# EAGLE design wav player 861 mosfet 5x5 (EAGLE 6.5.0)
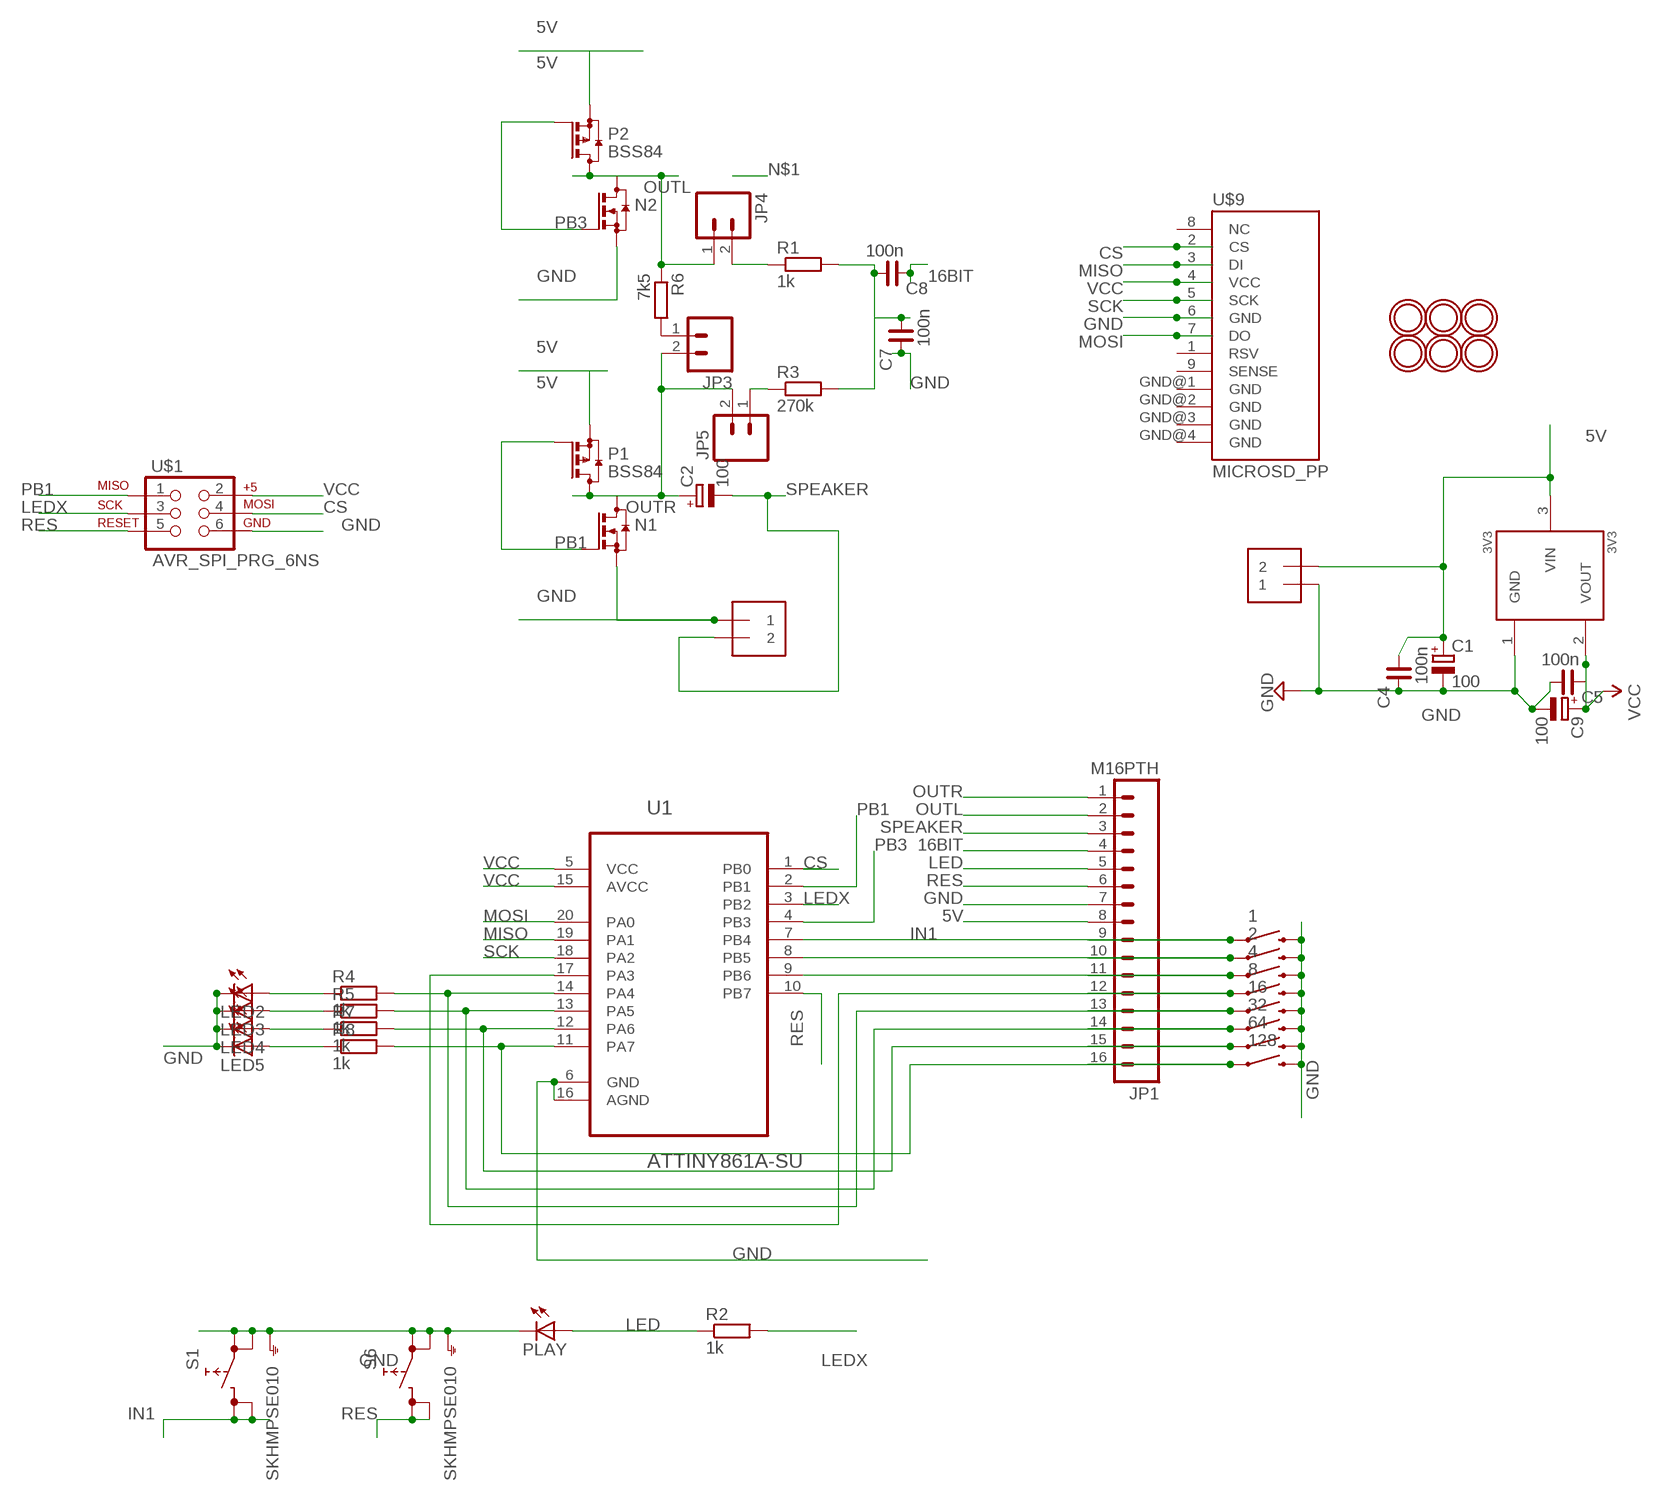
[diagram p0: schematic, sheet 1]

## Parts
1  SWITCH-MOMENTARY-2-SMD-1101NE  [TACTILE-SWITCH-1101NE]
2  SWITCH-MOMENTARY-2-SMD-1101NE  [TACTILE-SWITCH-1101NE]
3V3  3V3  MCP1700T  [SOT23]
4  SWITCH-MOMENTARY-2-SMD-1101NE  [TACTILE-SWITCH-1101NE]
8  SWITCH-MOMENTARY-2-SMD-1101NE  [TACTILE-SWITCH-1101NE]
16  SWITCH-MOMENTARY-2-SMD-1101NE  [TACTILE-SWITCH-1101NE]
32  SWITCH-MOMENTARY-2-SMD-1101NE  [TACTILE-SWITCH-1101NE]
64  SWITCH-MOMENTARY-2-SMD-1101NE  [TACTILE-SWITCH-1101NE]
128  SWITCH-MOMENTARY-2-SMD-1101NE  [TACTILE-SWITCH-1101NE]
C1  100  CPOL-EU153CLV-0605  [153CLV-0605]
C2  100  CPOL-EU153CLV-0605  [153CLV-0605]
C4  100n  C_0603  [C0603]
C5  100n  C_0603  [C0603]
C7  100n  C_0603  [C0603]
C8  100n  C_0603  [C0603]
C9  100  CPOL-EU153CLV-0605  [153CLV-0605]
J1  1X2-3.5MM  [1X2-3.5MM]
J2  1X2-3.5MM  [1X2-3.5MM]
JP1  M16PTH  [1X16]
JP3  M02PTH  [1X02]
JP4  M02PTH  [1X02]
JP5  M02PTH  [1X02]
LED2  LED3MM  [LED3MM]
LED3  LED3MM  [LED3MM]
LED4  LED3MM  [LED3MM]
LED5  LED3MM  [LED3MM]
N1  BSS123  [SOT23]
N2  BSS123  [SOT23]
P1  BSS84  [SOT23]
P2  BSS84  [SOT23]
PLAY  LED3MM  [LED3MM]
R1  1k  R-EU_R0603  [R0603]
R2  1k  R-EU_R0603  [R0603]
R3  270k  R-EU_R0603  [R0603]
R4  1k  R-EU_R0603  [R0603]
R5  1k  R-EU_R0603  [R0603]
R6  7k5  R-EU_R0603  [R0603]
R7  1k  R-EU_R0603  [R0603]
R8  1k  R-EU_R0603  [R0603]
S1  SKHMPSE010  [SKHMPXE010]
S6  SKHMPSE010  [SKHMPXE010]
U1  ATTINY861A-SU  [SOIC127P1032X265-20N]
U$1  AVR_SPI_PRG_6NS  [2X3-NS]
U$2  MOUNTINGHOLE2.0  [MOUNTINGHOLE_2.0_PLATED]
U$3  MOUNTINGHOLE2.0  [MOUNTINGHOLE_2.0_PLATED]
U$4  MOUNTINGHOLE2.0  [MOUNTINGHOLE_2.0_PLATED]
U$5  MOUNTINGHOLE2.0  [MOUNTINGHOLE_2.0_PLATED]
U$6  MOUNTINGHOLE2.0  [MOUNTINGHOLE_2.0_PLATED]
U$7  MOUNTINGHOLE2.0  [MOUNTINGHOLE_2.0_PLATED]
U$9  MICROSD_PP  [MICROSD_PP]

## Nets
5V [GND]: 3V3.3(VIN) C1.+ C4.1 J2.2 JP1.8 P1.2(S) P2.2(S)
16BIT: C8.2 JP1.4
CS: U1.1(PB0) U$1.4 U$9.2(CS)
GND: 1.P$2 2.P$2 3V3.1(GND) 4.P$2 8.P$2 16.P$2 32.P$2 64.P$2 128.P$2 C1.- C4.2 C5.1 C7.2 C9.- J1.1 J2.1 JP1.7 LED2.K(C) LED3.K(C) LED4.K(C) LED5.K(C) N1.2(S) N2.2(S) PLAY.K(C) S1.1(1.1) S1.2(1.2) S1.5(SH) S6.1(1.1) S6.2(1.2) S6.5(SH) U1.6(GND) U1.16(AGND) U$1.6 U$9.6(GND)
IN1: 1.P$1 JP1.9 S1.3(2.1) S1.4(2.2) U1.7(PB4)
LED: JP1.5 PLAY.A R2.1
LEDX: R2.2 U1.3(PB2) U$1.3
MISO: U1.19(PA1) U$9.3(DI)
MOSI: U1.20(PA0) U$9.7(DO)
N$2: JP3.1 R6.2
N$3: C7.1 C8.1 R1.2 R3.2
N$4: LED2.A R4.1
N$5: LED3.A R5.1
N$6: LED4.A R7.1
N$7: LED5.A R8.1
N$8: JP5.1 R3.1
N$9: JP4.2 R1.1
N$12: 2.P$1 JP1.10 U1.8(PB5)
N$13: 4.P$1 JP1.11 U1.9(PB6)
N$14: 8.P$1 JP1.12 U1.17(PA3)
N$15: 16.P$1 JP1.13 R4.2 U1.14(PA4)
N$16: 32.P$1 JP1.14 R5.2 U1.13(PA5)
N$17: 64.P$1 JP1.15 R7.2 U1.12(PA6)
N$18: 128.P$1 JP1.16 R8.2 U1.11(PA7)
OUTL: JP1.2 JP4.1 N2.3(D) P2.3(D) R6.1
OUTR: C2.+ JP1.1 JP3.2 JP5.2 N1.3(D) P1.3(D)
PB1: N1.1(G) P1.1(G) U1.2(PB1) U$1.1
PB3: N2.1(G) P2.1(G) U1.4(PB3)
RES: JP1.6 S6.3(2.1) S6.4(2.2) U1.10(PB7) U$1.5
SCK: U1.18(PA2) U$9.5(SCK)
SPEAKER: C2.- J1.2 JP1.3
VCC: 3V3.2(VOUT) C5.2 C9.+ U1.5(VCC) U1.15(AVCC) U$1.2 U$9.4(VCC)
Unconnected: U$9.1(RSV) U$9.8(NC) U$9.9(SENSE) U$9.GND@1(GND) U$9.GND@2(GND) U$9.GND@3(GND) U$9.GND@4(GND)

## Library data of the parts
1 2 4 8 16 32 64 128 = SparkFun:SWITCH-MOMENTARY-2
3V3 = okie:MCP1700T
C1 C2 C9 = resistor:CPOL-EU: POLARIZED CAPACITOR, European symbol
C4 C5 C7 C8 = rc-master-smd:C_: NON-POLARIZED CAP
J1 J2 = adafruit:1X2: 3.5mm Terminal block http://www.ladyada.net/library/pcb/eaglelibrary.html
JP1 = SparkFun:M16
JP3-JP5 = SparkFun:M02: Header 2 Standard 2-pin 0.1" header. Use with straight break away headers (SKU : PRT-00116), right angle break away headers (PRT-00553), swiss pins (PRT-00743), machine pins (PRT-00117), and female headers (PRT-00115). Molex polarized connector foot print use with SKU : PRT-08233 with associated crimp pins and housings.
LED2-LED5 PLAY = led:LED: LED OSRAM: - CHIPLED LG R971, LG N971, LY N971, LG Q971, LY Q971, LO R971, LY R971 LH N974, LH R974 LS Q976, LO Q976, LY Q976 LO Q996 - Hyper CHIPLED LW Q18S LB Q993, LB Q99A, LB R99A - SideLED LS A670, LO A670, LY A670, LG A670, LP A670 LB A673, LV A673, LT A673, LW A673 LH A674 LY A675 LS A676, LA A676, LO A676, LY A676, LW A676 LS A679, LY A679, LG A679 - Hyper Micro SIDELED® LS Y876, LA Y876, LO Y876, LY Y876 LT Y87S - SmartLED LW L88C, LW L88S LB L89C, LB L89S, LG L890 LS L89K, LO L89K, LY L89K LS L896, LA L896, LO L896, LY L896 - TOPLED LS T670, LO T670, LY T670, LG T670, LP T670 LSG T670, LSP T670, LSY T670, LOP T670, LYG T670 LG T671, LOG T671, LSG T671 LB T673, LV T673, LT T673, LW T673 LH T674 LS T676, LA T676, LO T676, LY T676, LB T676, LH T676, LSB T676, LW T676 LB T67C, LV T67C, LT T67C, LS T67K, LO T67K, LY T67K, LW E67C LS E67B, LA E67B, LO E67B, LY E67B, LB E67C, LV E67C, LT E67C LW T67C LS T679, LY T679, LG T679 LS T770, LO T770, LY T770, LG T770, LP T770 LB T773, LV T773, LT T773, LW T773 LH T774 LS E675, LA E675, LY E675, LS T675 LS T776, LA T776, LO T776, LY T776, LB T776 LHGB T686 LT T68C, LB T68C - Hyper Mini TOPLED® LB M676 - Mini TOPLED Santana® LG M470 LS M47K, LO M47K, LY M47K Source: http://www.osram.convergy.de LUXEON: - LUMILED® LXK2-PW12-R00, LXK2-PW12-S00, LXK2-PW14-U00, LXK2-PW14-V00 LXK2-PM12-R00, LXK2-PM12-S00, LXK2-PM14-U00 LXK2-PE12-Q00, LXK2-PE12-R00, LXK2-PE12-S00, LXK2-PE14-T00, LXK2-PE14-U00 LXK2-PB12-K00, LXK2-PB12-L00, LXK2-PB12-M00, LXK2-PB14-N00, LXK2-PB14-P00, LXK2-PB14-Q00 LXK2-PR12-L00, LXK2-PR12-M00, LXK2-PR14-Q00, LXK2-PR14-R00 LXK2-PD12-Q00, LXK2-PD12-R00, LXK2-PD12-S00 LXK2-PH12-R00, LXK2-PH12-S00 LXK2-PL12-P00, LXK2-PL12-Q00, LXK2-PL12-R00 Source: www.luxeon.com KINGBRIGHT: KA-3528ASYC Source: www.kingbright.com
N1 N2 = transistor-small-signal:BSS123: N-CHANNEL MOS FET
P1 P2 = transistor-small-signal:BSS84: P-CHANNEL MOS FET
R1-R8 = resistor:R-EU_: RESISTOR, European symbol
S1 S6 = switch:SKHMP*E010: 6.2 X 6.5mm TACT Switch (SMD) Source: http://www3.alps.co.jp/WebObjects/catalog.woa/PDF/E/Switch/Tact/SKHM/SKHM.PDF
U1 = Atmel_By_element14_Batch_1-00:ATTINY861A-SU: 8-bit Microcontroller with In-System Programmable Flash; MPN: ATTINY861A-SU; OC_FARNELL: 1841628; OC_NEWARK: 12T1344; PACKAGE: SOIC-20; SUPPLIER: Atmel
U$1 = SparkFun:AVR_SPI_PRG_6: AVR ISP 6 Pin This is the reduced ISP connector for AVR programming. Common on Arduino. This footprint will take up less PCB space and can be used with a 10-pin to 6-pin adapter such as SKU: BOB-08508
U$2-U$7 = microbuilder:MOUNTINGHOLE: Mounting Hole
U$9 = DE1594-v2:MICROSD_PP

## Net classes
0 default: width 0.305 mm, drill 0.381 mm, clearance 0.381 mm
1 GND: width 0.305 mm, drill 0.381 mm, clearance 0.381 mm
2 pwr: width 0.305 mm, drill 0.381 mm, clearance 0.381 mm

## Board
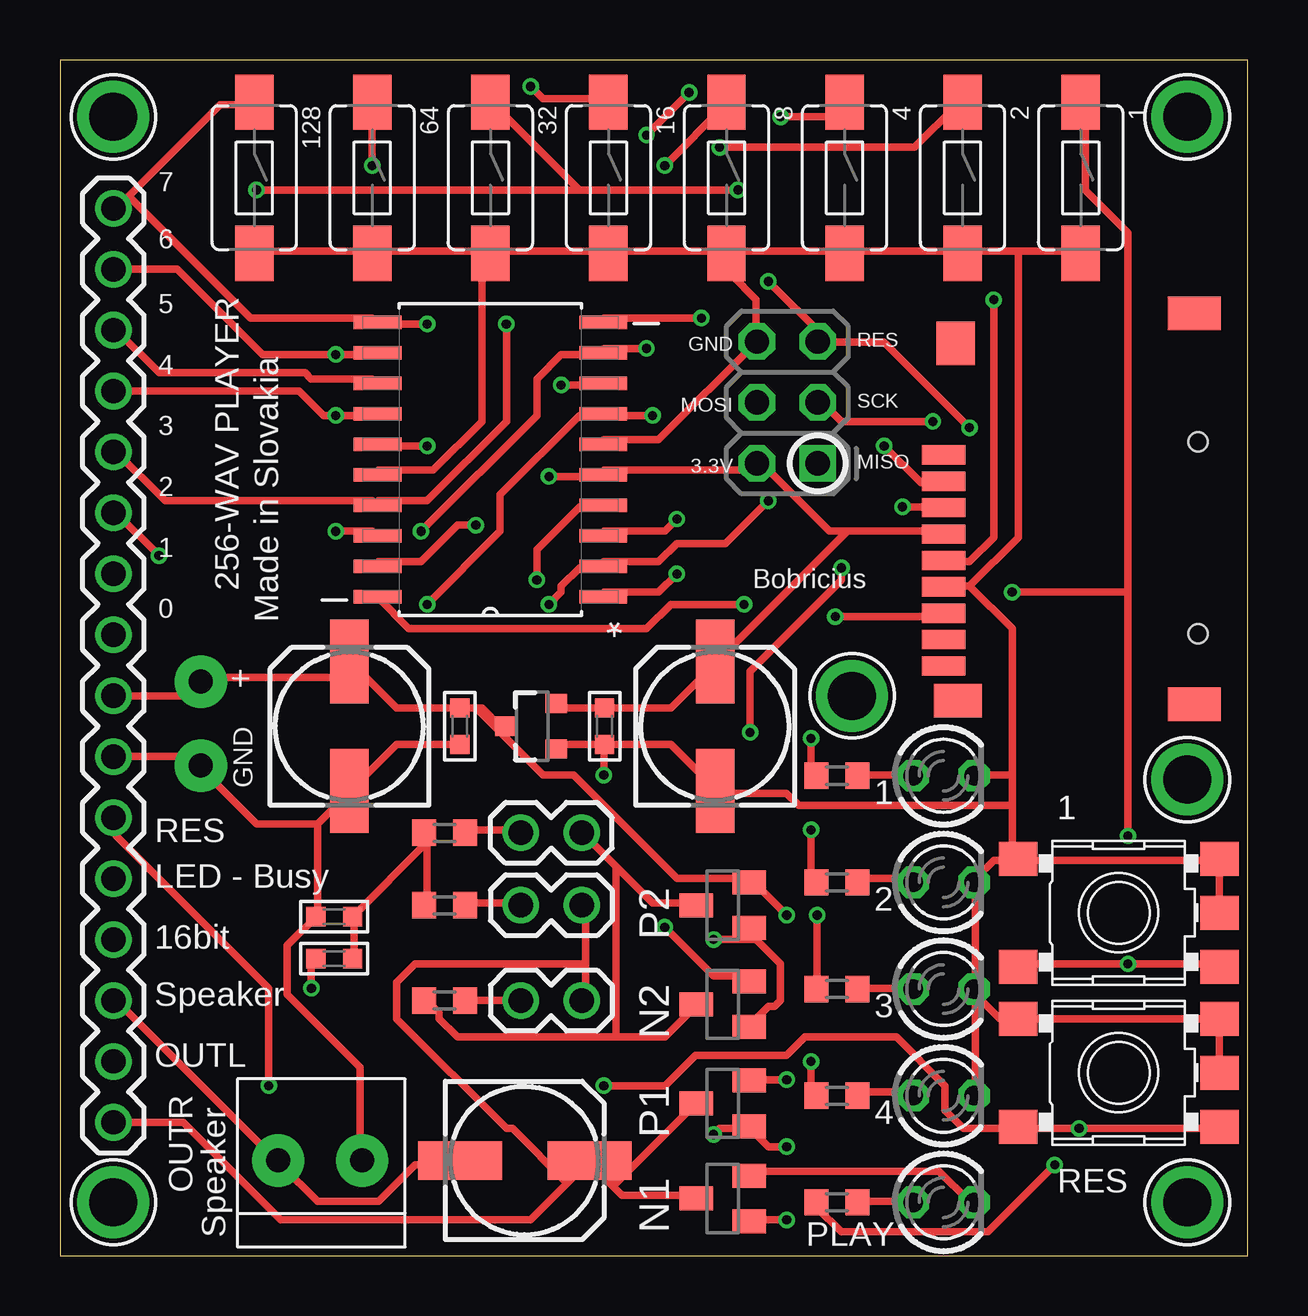
[diagram p1: board, top side]
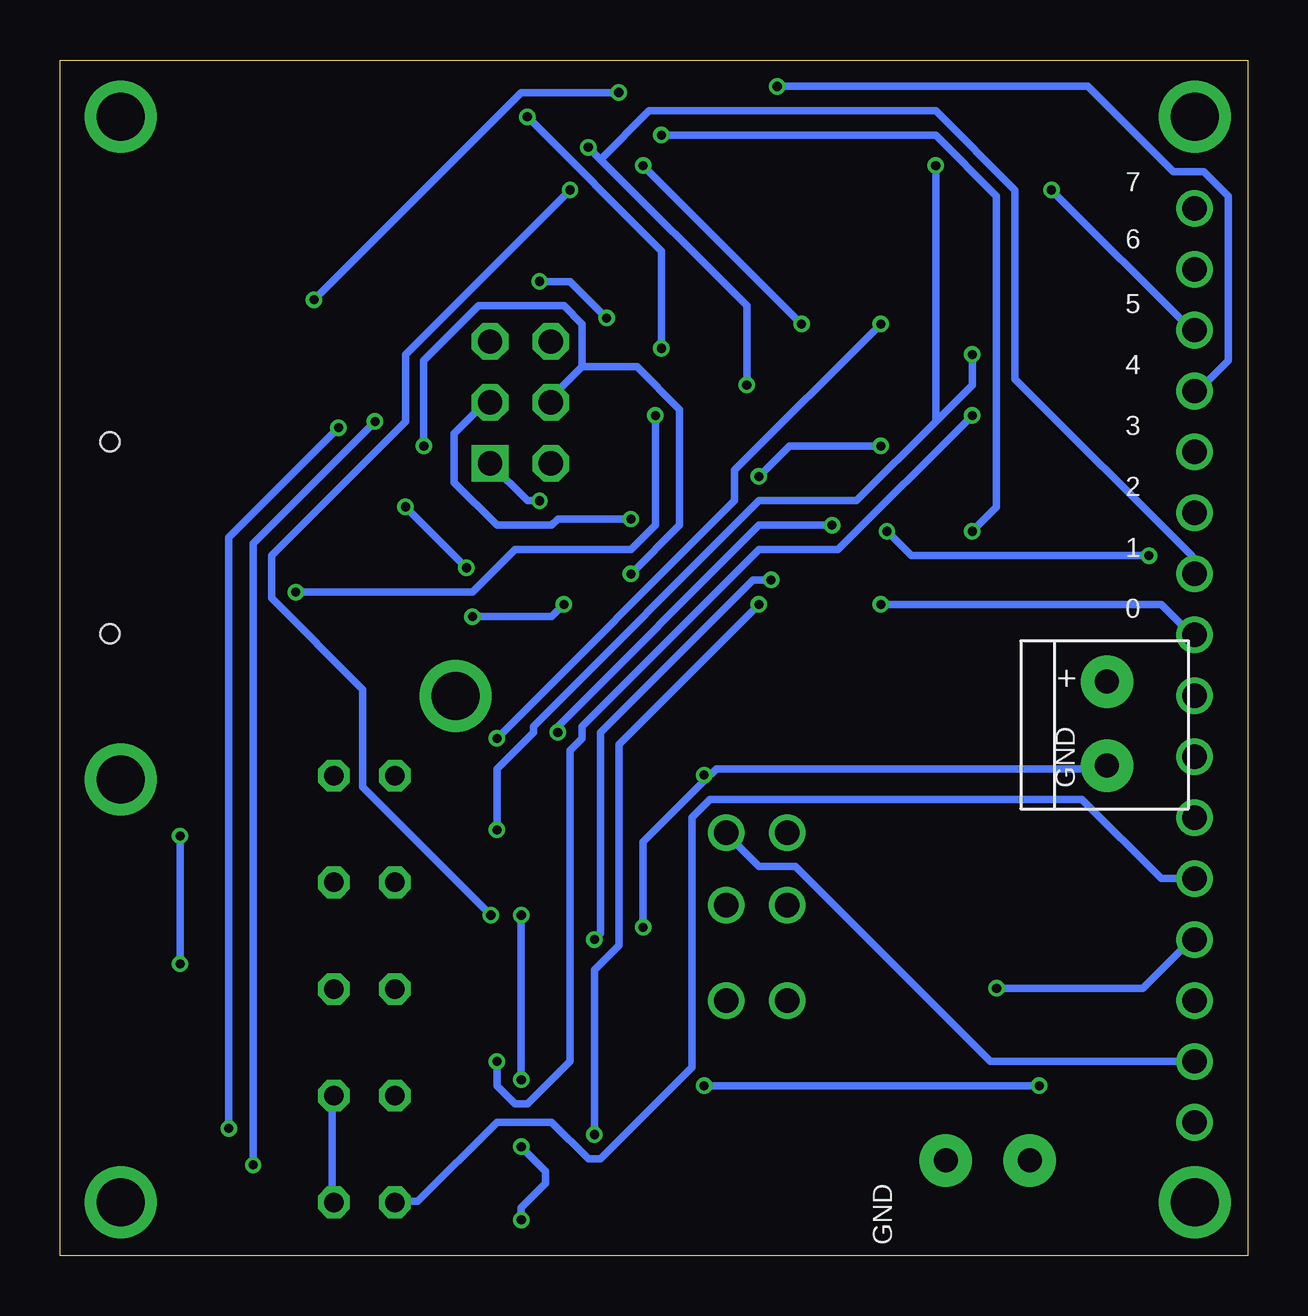
[diagram p2: board, bottom side, seen from below]

Size 49.52 x 49.84 mm. Coordinates in mm from the lower left corner, seen from the top.
Outline: 0,0 49.52,0 49.52,49.84 0,49.84 0,0
Copper layers (1*16): Top 0.035mm / dielectric 1.5mm / Bottom 0.035mm
Design rules "ITEADstudio_DRC": minimum track width 6mil, minimum drill 12mil, track to track 6mil, track to pad 6mil, pad to pad 6mil, via to via 6mil, smd to smd 0mil, copper to edge 10mil, drill to drill 10mil, minimum pad ring 10mil, minimum via ring 6mil, stop-mask expansion 2mil, vias tented up to drill 100mil, thermal gap 10mil

### Footprints (pad centres in the part's own frame; a part is rotated, then mirrored left to right if it is on the bottom)
TACTILE-SWITCH-1101NE = smd 2.3 x 1.6: P$1 -3.15,0; P$2 3.15,0
SOT23 = smd 0.8 x 0.9: 1 -0.95,-1; 2 0.95,-1; 3 0,1.1
153CLV-0605 = smd 3.5 x 1.6: + 2.7,0; - -2.7,0
C0603 = smd 0.8 x 0.8: 1 -0.762,0; 2 0.762,0
1X2-3.5MM = drill 1 pad 2.184: 1 1.8,0; 2 -1.7,0
1X16 = drill 1.016: 1 0,0; 2 2.54,0; 3 5.08,0; 4 7.62,0; 5 10.16,0; 6 12.7,0; 7 15.24,0; 8 17.78,0; 9 20.32,0; 10 22.86,0; 11 25.4,0; 12 27.94,0; 13 30.48,0; 14 33.02,0; 15 35.56,0; 16 38.1,0
1X02 = drill 1.016: 1 0,0; 2 2.54,0
LED3MM = drill 0.813 octagon: A -1.27,0; K 1.27,0
SOT23' = smd 1 x 1.4: 1 -0.95,-1.1; 2 0.95,-1.1; 3 0,1.1
R0603 = smd 1 x 1.1: 1 -0.85,0; 2 0.85,0
SKHMPXE010 = smd 1.6 x 1.4: 1 -4.2,2.25; 2 4.2,2.25; 3 -4.2,-2.25; 4 4.2,-2.25; 5 4.2,0
SOIC127P1032X265-20N = smd 1.981 x 0.559: 1 -4.699,5.715; 2 -4.699,4.445; 3 -4.699,3.175; 4 -4.699,1.905; 5 -4.699,0.635; 6 -4.699,-0.635; 7 -4.699,-1.905; 8 -4.699,-3.175; 9 -4.699,-4.445; 10 -4.699,-5.715; 11 4.699,-5.715; 12 4.699,-4.445; 13 4.699,-3.175; 14 4.699,-1.905; 15 4.699,-0.635; 16 4.699,0.635; 17 4.699,1.905; 18 4.699,3.175; 19 4.699,4.445; 20 4.699,5.715
2X3-NS = drill 1.016 square: 1 -2.54,-1.27 | drill 1.016 octagon: 2 -2.54,1.27; 3 0,-1.27; 4 0,1.27; 5 2.54,-1.27; 6 2.54,1.27
MOUNTINGHOLE_2.0_PLATED = drill 2 pad 3: P$1 0,0
MICROSD_PP = smd 1.8 x 0.8: 1 0,3.85; 2 0,2.75; 3 0,1.65; 4 0,0.55; 5 0,-0.55; 6 0,-1.65; 7 0,-2.75; 8 0,-3.85; 9 0,-4.95 | smd 1.6 x 1.8: GND@1 0.5,8.5 | smd 2.2 x 1.4: GND@2 10.45,9.75; GND@4 10.45,-6.55 | smd 2 x 1.4: GND@3 0.6,-6.4 | hole 0.8: 10.6,4.4; 10.6,-3.6

### Placement (x,y rotation side)
1  42.55,44.93 270 top
2  37.62,44.93 270 top
3V3  19.69,22.07 90 top
4  32.7,44.93 270 top
8  27.78,44.93 270 top
16  22.86,44.93 270 top
32  17.94,44.93 270 top
64  13.02,44.93 270 top
128  8.1,44.93 270 top
C1  12.07,22.07 90 top
C2  19.37,3.97 0 top
C4  16.67,22.07 270 top
C5  22.7,22.07 90 top
C7  11.43,14.13 180 top
C8  11.43,12.38 180 top
C9  27.3,22.07 90 top
J1  10.8,3.97 0 top
J2  5.87,22.23 270 bottom
JP1  2.22,5.56 90 top
JP3  19.21,10.64 0 top
JP4  21.75,17.62 180 top
JP5  19.21,14.61 0 top
LED2  36.83,6.67 0 top
LED3  36.83,11.11 0 top
LED4  36.83,15.56 0 top
LED5  36.83,20 0 top
N1  BSS123  [SOT23']  27.62,2.38 90 top
N2  BSS123  [SOT23']  27.62,10.48 90 top
P1  BSS84  [SOT23']  27.62,6.35 90 top
P2  BSS84  [SOT23']  27.62,14.61 90 top
PLAY  36.83,2.22 0 top
R1  16.03,17.62 180 top
R2  32.38,2.22 180 top
R3  16.03,14.61 180 top
R4  32.38,6.67 180 top
R5  32.38,11.11 180 top
R6  16.03,10.64 0 top
R7  32.38,15.56 180 top
R8  32.38,20 180 top
S1  44.13,14.29 0 top
S6  44.13,7.62 0 top
U1  17.94,33.18 180 top
U$1  30.32,35.56 90 top
U$2  2.22,2.22 0 top
U$3  2.22,47.47 0 top
U$4  46.99,47.47 0 top
U$5  46.99,2.22 0 top
U$6  33.02,23.34 0 top
U$7  46.99,19.84 0 top
U$9  36.83,29.53 0 top

### Tracks (layer width: path | path; a pad name or v marks a point on that pad's centre or on a via)
5V  (via drill 0.38)
  Top 0.305: JP1.8 5.14,23.34 5.65,23.84 J2.2 5.91,24.1 12.76,24.1 | v30.29,7.33 28.77,7.33 P1.2 | v30.29,14.19 28.77,15.72 P2.2 28.51,15.72 25.72,15.72 21.4,20.03 20.13,20.03 17.34,22.83 | 17.34,22.83 17.59,22.83 18.35,22.07 3V3.3 | 17.34,22.83 C4.1 14.03,22.83 12.76,24.1 | 12.76,24.1 12.26,24.61 C1.+ 12.76,24.1
  Bottom 0.305: v30.29,14.19 v30.29,7.33
16BIT  (via drill 0.38)
  Top 0.305: v10.48,11.14 10.48,12.16 C8.2
  Bottom 0.305: v10.48,11.14 4.38,11.14 2.35,13.18 JP1.4
CS  (via drill 0.38)
  Top 0.305: v34.35,33.75 35.88,32.23 36.64,32.23 U$9.2 | v25.72,28.42 24.96,27.65 22.67,27.65 U1.1
  Bottom 0.305: v34.35,33.75 34.35,37.31 32.07,39.59 28.51,39.59 27.75,38.83 27.75,37.05 | 27.75,37.05 29.02,35.78 U$1.4 | v25.72,28.42 23.69,30.45 23.69,35.27 25.46,37.05 27.75,37.05
GND  (via drill 0.38)
  Top 0.305: 10.73,18 10.73,14.19 C7.2 9.46,12.92 9.46,10.89 12.51,7.84 12.51,4.03 J1.1 | 10.73,18 12,19.27 C1.- 12.26,19.53 14.03,21.3 C4.2 | v25.21,13.68 27.24,11.65 28.51,11.65 N2.2 | JP1.7 5.4,20.8 5.65,20.54 J2.1 5.91,20.29 8.19,18 10.73,18 | 13.02,41.88 8.19,41.88 128.P$2 | U1.16 13.27,32.73 15.56,32.73 17.59,34.77 17.59,41.37 17.84,41.62 32.P$2 | 32.P$2 18.1,41.88 22.67,41.88 16.P$2 22.92,41.88 27.75,41.88 8.P$2 | 13.02,41.88 17.84,41.88 32.P$2 | 13.02,41.88 64.P$2 | U1.6 22.67,34 24.96,34 U$1.6 29.02,38.32 29.02,39.85 28,40.86 28,41.62 8.P$2 | 8.P$2 28,41.88 32.58,41.88 4.P$2 32.83,41.88 37.4,41.88 2.P$2 37.66,41.88 39.94,41.88 | 39.94,41.88 42.48,41.88 1.P$2 | N1.2 28.77,3.52 36.64,3.52 37.91,2.25 PLAY.K | S6.5 48.32,7.84 48.32,9.62 S6.2 48.32,9.87 39.94,9.87 S6.1 39.69,9.87 39.18,9.87 38.16,10.89 | 38.16,10.89 38.16,6.83 LED2.K | 38.16,10.89 LED3.K 38.16,11.14 38.16,15.46 LED4.K 38.16,15.72 38.93,16.48 39.69,16.48 S1.1 | 22.67,21.3 20.89,21.3 3V3.1 | 48.32,16.48 48.32,14.45 S1.5 | 37.91,27.91 36.89,27.91 U$9.6 | 37.91,27.91 39.69,26.13 39.69,20.03 | 39.69,18.76 39.69,16.73 S1.1 | 39.69,18.76 39.69,20.03 | 48.32,16.48 39.94,16.48 S1.1 | 48.32,16.48 S1.2 | 39.69,20.03 38.16,20.03 LED5.K | 39.69,18.76 30.8,18.76 30.29,19.27 27.5,19.27 C9.- 27.24,19.53 25.46,21.3 C5.1 22.67,21.3 | 39.94,41.88 39.94,29.94 37.91,27.91 | 22.67,21.3 v22.67,20.03
  Bottom 0.305: v25.21,13.68 25.21,17.24 22.67,19.78 | 22.67,19.78 22.16,20.29 5.91,20.29 J2.1 | PLAY.K 38.16,2.25 38.16,6.57 LED2.K | v22.67,20.03 22.67,19.78
IN1  (via drill 0.38)
  Top 0.305: v15.3,27.15 18.35,30.19 18.35,31.72 21.65,35.02 22.42,35.02 U1.7 22.67,35.02 v24.7,35.02 | S1.3 39.94,12.16 v44.51,12.16 48.32,12.16 S1.4 | v44.51,17.49 44.51,27.65 | 44.51,27.65 44.51,42.64 42.74,44.42 42.74,47.97 1.P$1 | 44.51,27.65 v39.69,27.65
  Bottom 0.305: v15.3,27.15 3.62,27.15 2.35,25.88 JP1.9 | v44.51,12.16 v44.51,17.49 | v24.7,35.02 24.7,30.45 25.72,29.43 30.54,29.43 32.32,27.65 v39.69,27.65
LED
  Top 0.305: R2.1 33.34,2.25 35.37,2.25 PLAY.A
  Bottom 0.305: JP1.5 3.62,15.72 6.92,19.02 22.42,19.02 23.18,18.26 23.18,7.84 26.99,4.03 27.5,4.03 29.02,5.56 31.31,5.56 34.61,2.25 35.37,2.25 PLAY.A
LEDX  (via drill 0.38)
  Top 0.305: v41.47,3.78 38.67,0.98 32.58,0.98 31.56,2 R2.2 | v36.39,34.77 32.58,34.77 31.81,35.53 U$1.3 | v25.72,30.7 25.21,30.19 22.67,30.19 U1.3
  Bottom 0.305: v41.47,3.78 41.47,29.69 v36.39,34.77 | v25.72,30.7 28.77,30.7 29.02,30.45 31.31,30.45 33.08,32.23 33.08,34.26 31.81,35.53 U$1.3
MISO  (via drill 0.38)
  Top 0.305: v35.12,31.21 36.64,31.21 U$9.3 | v32.58,28.67 32.58,28.16 28.77,24.35 v28.77,21.81 | v17.34,30.45 16.57,30.45 15.05,28.92 13.27,28.92 U1.19
  Bottom 0.305: v32.58,28.67 v35.12,31.21 | v28.77,21.81 28.77,22.07 20.38,30.45 v17.34,30.45
MOSI  (via drill 0.38)
  Top 0.305: v32.32,26.64 36.64,26.64 U$9.7 | v28.51,27.15 25.46,27.15 24.45,26.13 14.54,26.13 13.27,27.4 U1.20
  Bottom 0.305: v32.32,26.64 29.02,26.64 v28.51,27.15
N$2
  Top 0.305: JP3.1 R6.2
N$3
  Top 0.305: C8.1 12.26,12.41 12.26,13.94 C7.1 15.3,17.24 | 15.3,17.24 15.3,17.49 R1.2 15.3,17.24 | 15.3,17.24 15.3,14.7 R3.2
N$4
  Top 0.305: R4.1 33.34,6.83 35.37,6.83 LED2.A
N$5
  Top 0.305: R5.1 33.34,11.14 35.37,11.14 LED3.A
N$6
  Top 0.305: R7.1 33.34,15.72 35.37,15.72 LED4.A
N$7
  Top 0.305: R8.1 33.34,20.03 35.37,20.03 LED5.A
N$8
  Top 0.305: R3.1 17.08,14.7 19.11,14.7 JP5.1
N$9
  Top 0.305: R1.1 17.08,17.75 19.11,17.75 JP4.2
N$12  (via drill 0.38)
  Top 0.305: v20.89,36.29 22.42,36.29 U1.8 | v27.5,46.2 35.62,46.2 37.4,47.97 2.P$1
  Bottom 0.305: v20.89,36.29 20.89,39.59 26.99,45.69 | v27.5,46.2 26.99,45.69 | 26.99,45.69 24.96,47.72 13.02,47.72 9.72,44.42 9.72,36.54 2.35,29.18 2.35,28.42 JP1.10
N$13  (via drill 0.38)
  Top 0.305: v24.45,37.81 22.67,37.81 U1.9 22.42,37.56 20.89,37.56 19.88,36.54 19.88,35.02 v15.05,30.19 | v30.04,47.47 32.07,47.47 32.58,47.97 4.P$1 | v4.13,29.18 2.35,30.96 JP1.11
  Bottom 0.305: v24.45,37.81 24.45,41.88 v30.04,47.47 | v4.13,29.18 14.03,29.18 v15.05,30.19
N$14  (via drill 0.38)
  Top 0.305: JP1.12 2.35,33.5 4.38,31.46 13.02,31.46 U1.17 13.27,31.46 15.3,31.46 18.61,34.77 v18.61,38.83 | v25.21,45.43 27.75,47.97 8.P$1
  Bottom 0.305: v18.61,38.83 v25.21,45.43
N$15  (via drill 0.38)
  Top 0.305: v19.62,48.74 20.13,48.23 22.67,48.23 16.P$1 | v31.31,8.1 31.31,6.83 R4.2 | U1.14 13.02,35.02 v11.49,35.02 10.99,35.02 9.97,36.04 JP1.13
  Bottom 0.305: v19.62,48.74 6.67,48.74 3.11,45.18 1.84,45.18 0.83,44.16 0.83,37.31 2.1,36.04 JP1.13 | v31.31,8.1 31.31,7.08 30.54,6.32 30.04,6.32 28.26,8.1 28.26,21.05 27.75,21.56 27.75,22.07 20.38,29.43 17.08,29.43 v11.49,35.02
N$16  (via drill 0.38)
  Top 0.305: U1.13 13.02,36.54 10.48,36.54 10.22,36.8 4.13,36.8 2.35,38.58 JP1.14 | v31.56,14.19 31.56,11.14 R5.2 | 21.65,44.42 v28.26,44.42 | 21.65,44.42 18.1,47.97 32.P$1 | 21.65,44.42 v8.19,44.42
  Bottom 0.305: v31.56,14.19 36.89,19.53 36.89,23.59 40.7,27.4 40.7,29.18 35.12,34.77 35.12,37.56 v28.26,44.42 | v8.19,44.42 2.35,38.58 JP1.14
N$17  (via drill 0.38)
  Top 0.305: v31.31,17.75 31.31,15.72 R7.2 | U1.12 13.02,37.56 v11.49,37.56 8.45,37.56 4.89,41.12 JP1.15 | v13.02,45.43 64.P$1
  Bottom 0.305: v31.31,17.75 31.31,20.29 29.78,21.81 29.78,22.07 20.38,31.46 16.32,31.46 13.02,34.77 | 13.02,34.77 11.49,36.29 v11.49,37.56 | 13.02,34.77 v13.02,45.43
N$18  (via drill 0.38)
  Top 0.305: 2.86,44.16 2.35,43.66 JP1.16 | 2.86,44.16 6.67,47.97 7.94,47.97 128.P$1 | v31.31,21.56 31.31,20.03 R8.2 | v15.3,38.83 13.27,38.83 U1.11 13.02,39.08 7.94,39.08 2.86,44.16
  Bottom 0.305: v31.31,21.56 21.4,31.46 21.4,32.73 v15.3,38.83
OUTL
  Top 0.305: 23.18,9.11 25.21,9.11 26.48,10.38 N2.3 | 23.18,9.11 16.57,9.11 15.81,9.87 15.81,10.13 15.3,10.64 R6.1 | 23.18,16.22 21.91,17.49 JP4.1 | 23.18,16.22 24.7,14.7 26.48,14.7 P2.3 | 23.18,16.22 23.18,9.11
  Bottom 0.305: JP1.2 10.73,8.1 18.86,16.22 20.38,16.22 21.65,17.49 JP4.1
OUTR
  Top 0.305: 21.91,12.16 21.91,14.45 JP5.2 | 21.91,12.16 21.91,10.64 JP3.2 | 22.92,3.02 22.16,3.78 C2.+ 21.91,3.78 21.15,3.02 | 22.92,3.02 23.43,2.51 26.48,2.51 N1.3 | 22.92,3.02 23.18,3.02 26.48,6.32 P1.3 | JP1.1 5.14,5.56 9.21,1.49 19.62,1.49 21.15,3.02 | 21.91,12.16 14.8,12.16 14.03,11.4 14.03,9.87 18.61,5.3 18.86,5.3 21.15,3.02
PB1  (via drill 0.38)
  Top 0.305: v30.29,1.49 28.77,1.49 N1.1 | v30.29,4.54 29.53,4.54 28.77,5.3 P1.1 28.51,5.3 27.5,5.3 v27.24,5.05 | v29.53,31.46 27.75,29.69 25.72,29.69 24.96,28.92 22.67,28.92 U1.2 22.42,28.67 21.65,28.67 20.89,27.91 20.89,27.65 v20.38,27.15
  Bottom 0.305: v30.29,1.49 30.29,2 29.27,3.02 29.27,3.52 v30.29,4.54 | v29.53,31.46 30.04,31.46 U$1.1 | v27.24,5.05 27.24,11.91 26.23,12.92 26.23,21.3 v20.38,27.15
PB3  (via drill 0.38)
  Top 0.305: 29.02,13.18 28.77,13.43 P2.1 29.02,13.18 | 29.02,13.18 30.04,12.16 30.04,10.64 29.78,10.38 29.53,10.38 28.77,9.62 N2.1 | v19.88,28.16 19.88,29.43 21.65,31.21 22.42,31.21 U1.4 | 29.02,13.18 v27.24,13.18
  Bottom 0.305: v19.88,28.16 20.64,28.16 26.99,21.81 26.99,13.43 v27.24,13.18
RES  (via drill 0.38)
  Top 0.305: v26.73,39.08 22.67,39.08 U1.10 | v29.53,40.61 31.81,38.32 U$1.5 31.81,38.07 34.35,38.07 v37.91,34.51 | S6.4 48.32,5.3 v42.48,5.3 39.94,5.3 S6.3 39.69,5.3 37.66,5.3 36.89,6.06 36.89,7.08 34.86,9.11 31.05,9.11 30.29,8.35 26.48,8.35 25.21,7.08 v22.67,7.08 | v8.7,7.08 8.7,11.14 2.35,17.49 2.35,18.26 JP1.6
  Bottom 0.305: v26.73,39.08 28.26,40.61 v29.53,40.61 | v22.67,7.08 v8.7,7.08 | v37.91,34.51 42.48,29.94 v42.48,5.3
SCK  (via drill 0.38)
  Top 0.305: v38.93,39.85 38.93,29.94 37.91,28.92 36.89,28.92 U$9.5 | v24.45,46.7 v26.23,48.48 | v11.49,30.19 13.02,30.19 U1.18
  Bottom 0.305: v38.93,39.85 30.29,48.48 v26.23,48.48 | v24.45,46.7 13.02,46.7 10.48,44.16 10.48,31.21 v11.49,30.19
SPEAKER
  Top 0.305: JP1.3 2.35,10.64 8.95,4.03 J1.2 9.21,3.78 10.73,2.25 13.27,2.25 14.8,3.78 16.57,3.78 C2.-
VCC  (via drill 0.38)
  Top 0.305: 3V3.2 20.89,22.83 C5.2 25.46,22.83 27.24,24.61 C9.+ 27.5,24.86 32.83,30.19 | 32.83,30.19 32.07,30.19 29.53,32.73 | 32.83,30.19 36.64,30.19 U$9.4 | 29.53,32.73 29.27,32.99 U$1.2 29.53,32.73 | 29.53,32.73 22.67,32.73 U1.5 22.42,32.48 v20.38,32.48 | v15.3,33.75 13.27,33.75 U1.15
  Bottom 0.305: v15.3,33.75 19.11,33.75 v20.38,32.48

### Text on the board
tNames: 7 | 6 | 5 | 256-WAV PLAYER | GND | RES | 4 | MOSI | SCK | 3 | 3.3V | MISO | 2 | 1 | Bobricius | 0 | Made in Slovakia | + | GND | 1 | 1 | RES | LED - Busy | 2 | 16bit | Speaker | 3 | OUTL | OUTR | 4 | RES | Speaker | PLAY
bNames: 7 | 6 | 5 | 4 | 3 | 2 | 1 | 0 | + | GND | GND